# Altium schematic sheet LvlTranslate.SchDoc
size Letter; Author: Adam Gilbert; CompanyName: McGill University; DrawnBy: Adam Gilbert; Organization: Altium Limited; Address1: McGill Cosmology; Address2: 3600 University Street; Address3: Montreal, Quebec; Address4: Canada; DocumentNumber: 9; Revision: Rev2; SheetNumber: 9; SheetTotal: 16; ProjectTitle: DfMux FMC Mezz; ModelNumber: MGMEZZ04; ProjectName: DfMux FMC Mezz
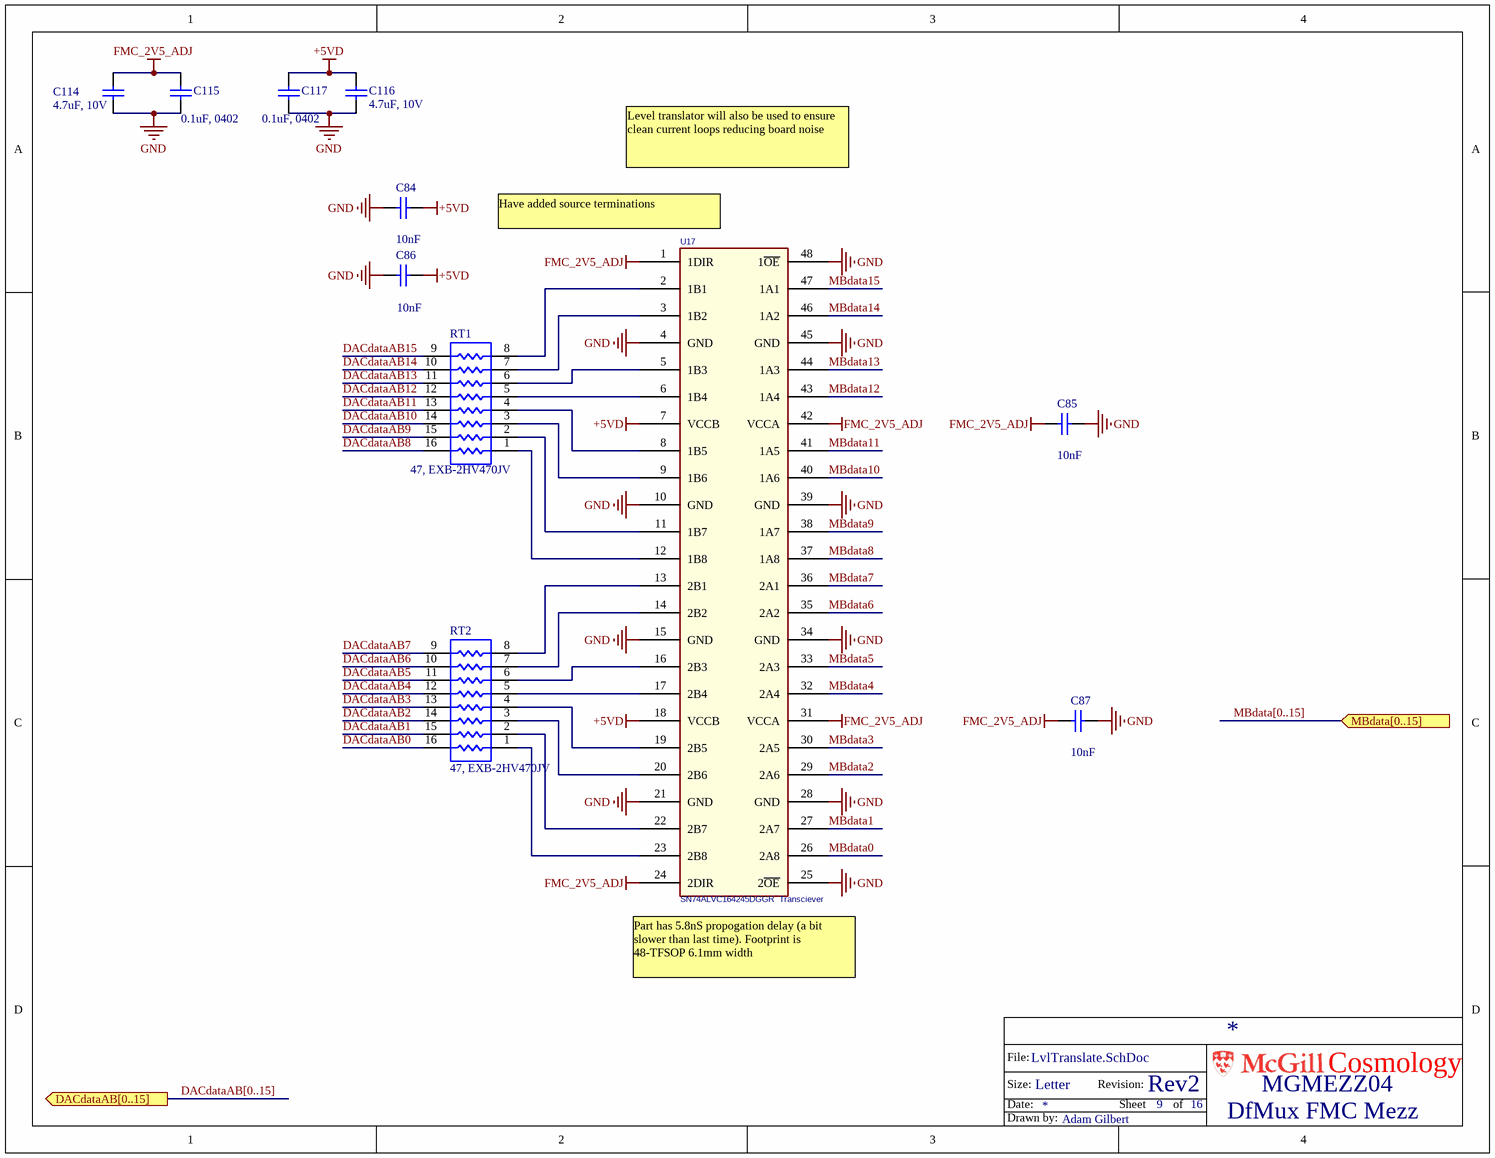
[diagram p0: LvlTranslate.SchDoc]

## Parts
C84  10nF  [0402]
C85  10nF  [0402]
C86  10nF  [0402]
C87  10nF  [0402]
C114  4.7uF, 10V  [0805]
C115  0.1uF, 0402  [0402]
C116  4.7uF, 10V  [0805]
C117  0.1uF, 0402  [0402]
RT1  47, EXB-2HV470JV  [0402_Array_2HV]
RT2  47, EXB-2HV470JV  [0402_Array_2HV]
U17  SN74ALVC164245DGGR  Transciever  [TSSOP48-0.5mmpitch]

## Ports
DACdataAB[0..15] (out), MBdata[0..15] (in)

## Nets
+5VD: C84.2 C86.2 C116.2 C117.2 U17.7(VCCB) U17.18(VCCB)
FMC_2V5_ADJ: C85.1 C87.1 C114.2 C115.2 U17.1(1DIR) U17.24(2DIR) U17.31(VCCA) U17.42(VCCA)
GND: C84.1 C85.2 C86.1 C87.2 C114.1 C115.1 C116.1 C117.1 U17.4(GND) U17.10(GND) U17.15(GND) U17.21(GND) U17.25(2~{OE}) U17.28(GND) U17.34(GND) U17.39(GND) U17.45(GND) U17.48(1~{OE})
DACdataAB0: RT2.16
DACdataAB1: RT2.15
DACdataAB2: RT2.14
DACdataAB3: RT2.13
DACdataAB4: RT2.12
DACdataAB5: RT2.11
DACdataAB6: RT2.10
DACdataAB7: RT2.9
DACdataAB8: RT1.16
DACdataAB9: RT1.15
DACdataAB10: RT1.14
DACdataAB11: RT1.13
DACdataAB12: RT1.12
DACdataAB13: RT1.11
DACdataAB14: RT1.10
DACdataAB15: RT1.9
MBdata0: U17.26(2A8)
MBdata1: U17.27(2A7)
MBdata2: U17.29(2A6)
MBdata3: U17.30(2A5)
MBdata4: U17.32(2A4)
MBdata5: U17.33(2A3)
MBdata6: U17.35(2A2)
MBdata7: U17.36(2A1)
MBdata8: U17.37(1A8)
MBdata9: U17.38(1A7)
MBdata10: U17.40(1A6)
MBdata11: U17.41(1A5)
MBdata12: U17.43(1A4)
MBdata13: U17.44(1A3)
MBdata14: U17.46(1A2)
MBdata15: U17.47(1A1)
NetRT1_1: RT1.1 U17.12(1B8)
NetRT1_2: RT1.2 U17.11(1B7)
NetRT1_3: RT1.3 U17.9(1B6)
NetRT1_4: RT1.4 U17.8(1B5)
NetRT1_5: RT1.5 U17.6(1B4)
NetRT1_6: RT1.6 U17.5(1B3)
NetRT1_7: RT1.7 U17.3(1B2)
NetRT1_8: RT1.8 U17.2(1B1)
NetRT2_1: RT2.1 U17.23(2B8)
NetRT2_2: RT2.2 U17.22(2B7)
NetRT2_3: RT2.3 U17.20(2B6)
NetRT2_4: RT2.4 U17.19(2B5)
NetRT2_5: RT2.5 U17.17(2B4)
NetRT2_6: RT2.6 U17.16(2B3)
NetRT2_7: RT2.7 U17.14(2B2)
NetRT2_8: RT2.8 U17.13(2B1)

## Buses and harness runs
bus DACdataAB[0..15] = port DACdataAB[0..15]
bus MBdata[0..15] = port MBdata[0..15]

## Notes on the sheet
- Level translator will also be used to ensure clean current loops reducing board noise
- (near U17) Have added source terminations
- (near U17) Part has 5.8nS propogation delay (a bit slower than last time). Footprint is 48-TFSOP 6.1mm width
- File:
- Size:
- Date:
- Letter
- Revision:
- Sheet
- of
- Cosmology
- Drawn by:

## Library data of the parts
C84-C87 = CAP 0402: Capacitor, Ceramic, 0402; Part Constraints: 10% 16V X7R 0402; Manufacturer Part Number 1: GRM15XR71C103KA86D; Manufacturer: Murata Electronics North America; Assembly Comments: none; Temperature Coefficient: X7R; Supplier 1: Digi-Key; Operating Temperature: -55°C ~ 125°C; Thickness (Max): 0.012" (0.30mm); Packaging: Cut Tape (CT); Supplier Part Number 1: 490-6370-1-ND; Value: 10nF
C114 C116 = CAP 0805: Capacitor, Ceramic, 0805; Manufacturer Part Number 1: LMK212BJ475KD-T; Manufacturer: Taiyo Yuden; Temperature Coefficient: X5R; Assembly Comments: none; Supplier 1: Digi-Key; Supplier Part Number 1: 587-1297-6-ND; Packaging: Digi-Reel®; Operating Temperature: -55°C ~ 85°C; Thickness (Max): 0.037" (0.95mm); Value: 4.7uF, 10V; Part Constraints: LMK212BJ475KD-T
C115 C117 = CAP 0603: Capacitor, Ceramic, 0402; Part Constraints: 10% 10V X5R 0402; Manufacturer: TDK Corporation; Manufacturer Part Number 1: C1005X5R1A104K050BA; Temperature Coefficient: X5R; Assembly Comments: none; Value: 0.1uF, 0402; Supplier 1: Digi-Key; Supplier Part Number 1: 445-1265-1-ND; Operating Temperature: -55°C ~ 85°C; Thickness (Max): 0.022" (0.55mm); Packaging: Cut Tape (CT)
RT1 RT2 = Res_Pack: RES ARRAY 47 OHM SMD; Manufacturer: Panasonic - ECG; Assembly Comments: none; Part constraints: EXB-2HV470JV; Manufacturer Part Number 1: EXB-2HV470JV; Supplier 1: Digikey; Supplier Part Number 1: Y1470CT-ND
U17 = SN74ALVC164245DGGR Transciever: Manufacturer: Texas Instruments; Assembly Comments: none; Manufacturer Part Number 1: SN74ALVC164245DGGR; Part Constraints: SN74ALVC164245DGGR; Operating Temperature: -40°C ~ 85°C; Packaging: Cut Tape (CT); Supplier 1: Digi-Key; Supplier Part Number 1: 296-1135-1-ND